# Altium schematic sheet Control_Pilot.SchDoc
size B; SheetNumber: 1; SheetTotal: 8
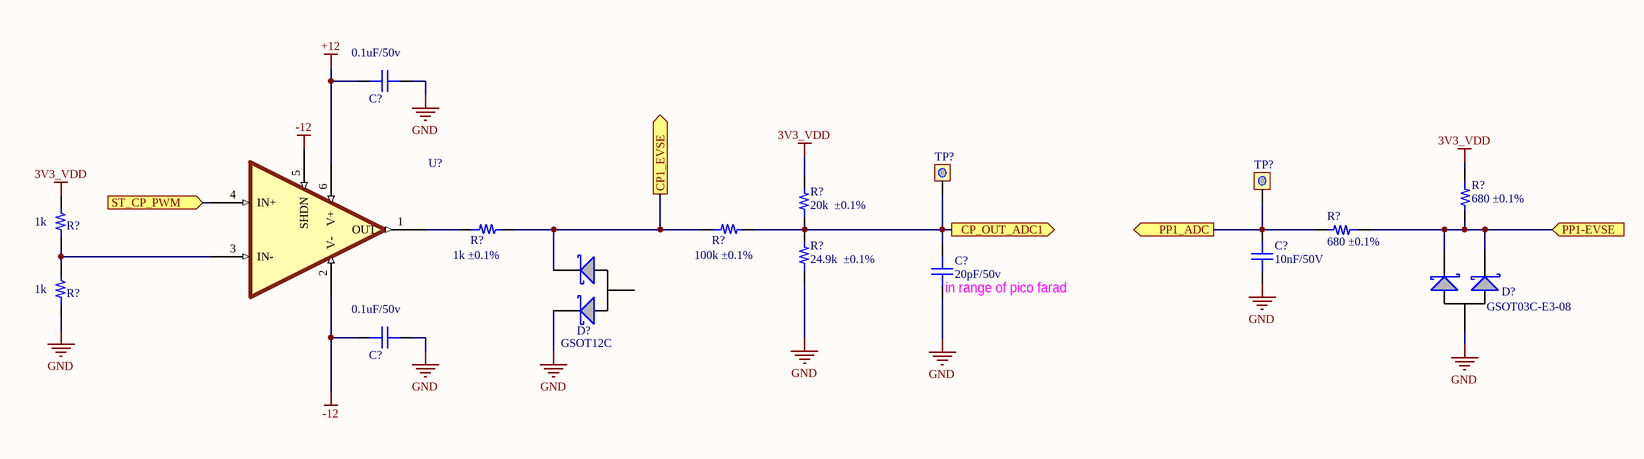
[diagram p0: Control_Pilot.SchDoc]

## Parts
(Parts that share a designator on the sheet are numbered #1, #2 ... from top to bottom, then left to right.)
C?#1  value 0.1uF/50v  [C1206]  (hidden comment: Capacitor)
C?#2  value 10nF/50V  [C1206]  (hidden comment: Capacitor)
C?#3  value 20pF/50v  [C1206]  (hidden comment: Capacitor)
C?#4  value 0.1uF/50v  [C1206]  (hidden comment: Capacitor)
D?#1  value GSOT12C  (hidden comment: GSOT12C-E3-08)
D?#2  GSOT03C-E3-08
R?#1  value 680 ±0.1%  [R0603]  (hidden comment: Resistor)
R?#2  value 1k ±0.1%  [R0603]  (hidden comment: Resistor)
R?#3  value 100k ±0.1%  [R0603]  (hidden comment: Resistor)
R?#4  value 20k  ±0.1%  [R0603]  (hidden comment: Resistor)
R?#5  value 680 ±0.1%  [R0603]  (hidden comment: Resistor)
R?#6  value 1k  [R0402]  (hidden comment: Resistor)
R?#7  value 24.9k  ±0.1%  [R0603]  (hidden comment: Resistor)
R?#8  value 1k  [R0402]  (hidden comment: Resistor)
TP?#1  TEST-PIN  [Test_Pin]  (value not drawn)  (no BOM)
TP?#2  TEST-PIN  [Test_Pin]  (value not drawn)  (no BOM)
U?  Comparator  [SOT-23-6]  (value not drawn)

## Ports
CP1_EVSE (out), CP_OUT_ADC1 (out), PP1-EVSE (in), PP1_ADC (out), ST_CP_PWM (in)

## Nets
3V3_VDD: R?#1.1 R?#4.1 R?#6.1
+12: C?#1.1 U?.6(V+)
-12: C?#4.1 U?.2(V-) U?.5(SHDN)
GND: C?#1.1 C?#2.1 C?#3.1 C?#4.1 D?#1.1(K1) D?#2.3(A) R?#7.1 R?#8.1
CP1_EVSE: D?#1.2(K2) R?#2.1 R?#3.1 ; port CP1_EVSE
CP_OUT_ADC1: C?#3.1 R?#3.1 R?#4.1 R?#7.1 TP?#1.1(TP) ; port CP_OUT_ADC1
PP1-EVSE: D?#2.1(K1) D?#2.2(K2) R?#1.1 R?#5.1 ; port PP1-EVSE
PP1_ADC: C?#2.1 R?#5.1 TP?#2.1(TP) ; port PP1_ADC
ST_CP_PWM: U?.4(IN+) ; port ST_CP_PWM
NetR?#2_1: R?#2.1 U?.1(OUT)
NetR?#6_1: R?#6.1 R?#8.1 U?.3(IN-)

Not connected (* = marked no-connect by the designer): D?#1 3(A)

## Notes on the sheet
- (near C?#3) in range of pico farad

## Library data of the parts
C?#1-C?#4 = CAP_SMT: ComponentLink1Description: New link
D?#1 D?#2 = GSOT03C-E3-08: 12.3V Clamp 30A (8/20µs) Ipp Tvs Diode Surface Mount SOT-23-3; ComponentLink1Description: New link
  D?#2: value: GSOT03C-E3-08
R?#1-R?#8 = RES_SMT: ComponentLink1Description: New link; ComponentLink1URL: *
U? = TLV1805QDBVRQ1: Automotive high volt comparator with push-pull output and shutdown 6-SOT-23 -40 to 125; ComponentLink1Description: New link; ComponentLink1URL: *
TP?#1 TP?#2 = TEST-PIN: ComponentLink1Description: Link